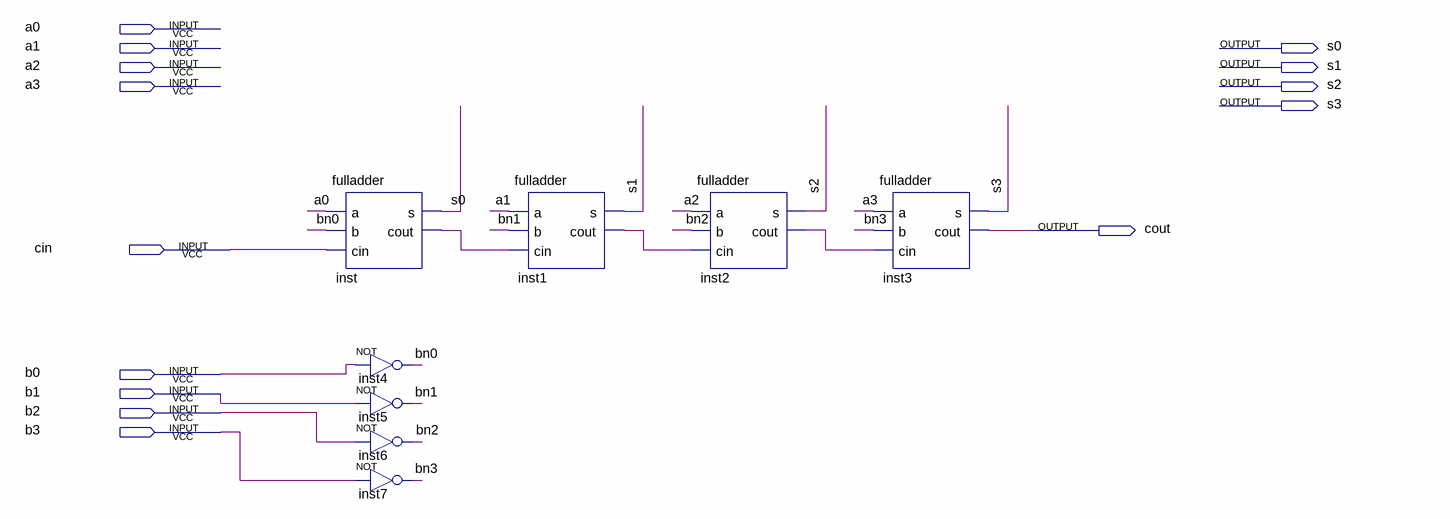
[diagram p0: schematic sheet]
// Quartus schematic subtrator.bdf as structural Verilog: 8 symbols, 14 pins
module subtrator (
  input  a0,
  input  a1,
  input  a2,
  input  a3,
  input  cin,
  input  b0,
  input  b1,
  input  b2,
  input  b3,
  output s0,
  output s1,
  output s2,
  output s3,
  output cout
);

  wire bn0, bn1, bn2, bn3, inst1_cout, inst2_cout, inst_cout;

  fulladder inst (.a(a0), .b(bn0), .cin(cin), .s(s0), .cout(inst_cout));
  not inst4 (bn0, b0);
  not inst5 (bn1, b1);
  not inst6 (bn2, b2);
  not inst7 (bn3, b3);
  fulladder inst1 (.a(a1), .b(bn1), .cin(inst_cout), .s(s1), .cout(inst1_cout));
  fulladder inst2 (.a(a2), .b(bn2), .cin(inst1_cout), .s(s2), .cout(inst2_cout));
  fulladder inst3 (.a(a3), .b(bn3), .cin(inst2_cout), .s(s3), .cout(cout));
endmodule
